# Altium schematic sheet Segment_Register.SchDoc
size A; SheetNumber: 3; SheetTotal: 5
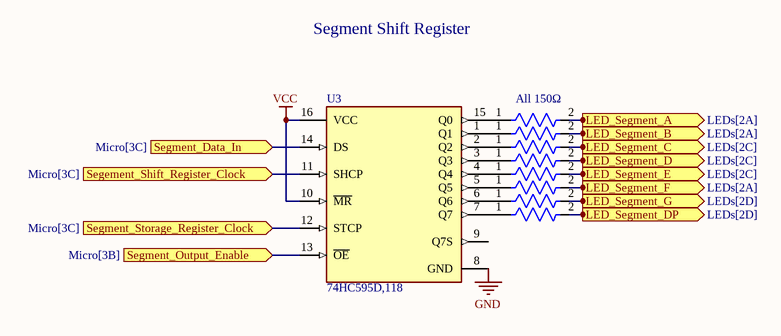
[diagram p0: Segment_Register.SchDoc]

## Parts
R2  CRCW0402150RFKED  [FP-CRCW0402-e3-IPC_A]  (value not drawn)
R3  CRCW0402150RFKED  [FP-CRCW0402-e3-IPC_A]  (value not drawn)
R4  CRCW0402150RFKED  [FP-CRCW0402-e3-IPC_A]  (value not drawn)
R5  CRCW0402150RFKED  [FP-CRCW0402-e3-IPC_A]  (value not drawn)
R6  CRCW0402150RFKED  [FP-CRCW0402-e3-IPC_A]  (value not drawn)
R7  CRCW0402150RFKED  [FP-CRCW0402-e3-IPC_A]  (value not drawn)
R8  CRCW0402150RFKED  [FP-CRCW0402-e3-IPC_A]  (value not drawn)
R9  CRCW0402150RFKED  [FP-CRCW0402-e3-IPC_A]  (value not drawn)
U3  74HC595D,118  [FP-SOT109-1-IPC_C]

## Ports
LED_Segment_A (out, see LEDs[2A]), LED_Segment_B (out, see LEDs[2A]), LED_Segment_C (out, see LEDs[2C]), LED_Segment_D (out, see LEDs[2C]), LED_Segment_DP (out, see LEDs[2D]), LED_Segment_E (out, see LEDs[2C]), LED_Segment_F (out, see LEDs[2A]), LED_Segment_G (out, see LEDs[2D]), Segement_Shift_Register_Clock (in, see Micro[3C]), Segment_Data_In (in, see Micro[3C]), Segment_Output_Enable (in, see Micro[3B]), Segment_Storage_Register_Clock (in, see Micro[3C])

## Nets
GND: U3.8(GND)
VCC: U3.10(~{MR}) U3.16(VCC)
LED_Segment_A: R2.2 ; port LED_Segment_A
LED_Segment_B: R3.2 ; port LED_Segment_B
LED_Segment_C: R4.2 ; port LED_Segment_C
LED_Segment_D: R5.2 ; port LED_Segment_D
LED_Segment_DP: R9.2 ; port LED_Segment_DP
LED_Segment_E: R6.2 ; port LED_Segment_E
LED_Segment_F: R7.2 ; port LED_Segment_F
LED_Segment_G: R8.2 ; port LED_Segment_G
Segement_Shift_Register_Clock: U3.11(SHCP) ; port Segement_Shift_Register_Clock
Segment_Data_In: U3.14(DS) ; port Segment_Data_In
Segment_Output_Enable: U3.13(~{OE}) ; port Segment_Output_Enable
Segment_Storage_Register_Clock: U3.12(STCP) ; port Segment_Storage_Register_Clock
NetR2_1: R2.1 U3.15(Q0)
NetR3_1: R3.1 U3.1(Q1)
NetR4_1: R4.1 U3.2(Q2)
NetR5_1: R5.1 U3.3(Q3)
NetR6_1: R6.1 U3.4(Q4)
NetR7_1: R7.1 U3.5(Q5)
NetR8_1: R8.1 U3.6(Q6)
NetR9_1: R9.1 U3.7(Q7)

Not connected (* = marked no-connect by the designer): U3 9(Q7S)

## Notes on the sheet
- Segment Shift Register
- (near R2) All 150Ω

## Library data of the parts
R2-R9 = CMP-2002-08214-2: RES Thick Film, 150Ω, 1%, 0.063W, 100ppm/°C, 0402; Power Rating: 63mW; Voltage Rating: 50V; Resistance: 150R; Packaging: Tape and Reel; Height: 0.35mm; Radiation Hardening: No; Min Operating Temperature: -55°C; Mount: Surface Mount; Contact Plating: Tin; Case/Package: 0402; Width: 0.5mm; Case Code (Imperial): 0402; Length: 1mm; Tolerance: 1%; Lead Free: Lead Free; Case Code (Metric): 1005; Military Standard: Not; Max Operating Temperature: 155°C; Temperature Coefficient: 100ppm/°C; Weight: 2.3E-05oz; Voltage Rating (DC): 50V; Depth: 0.5mm; Package Quantity: 10000; Composition: Thick Film; Termination: SMD/SMT
U3 = CMP-14351-000006-1: IC SHIFT REGISTER 8BIT 16SOIC; RoHS Compliant: Yes